# Altium project Prolift_MatrixDisplay_small.PrjPcb
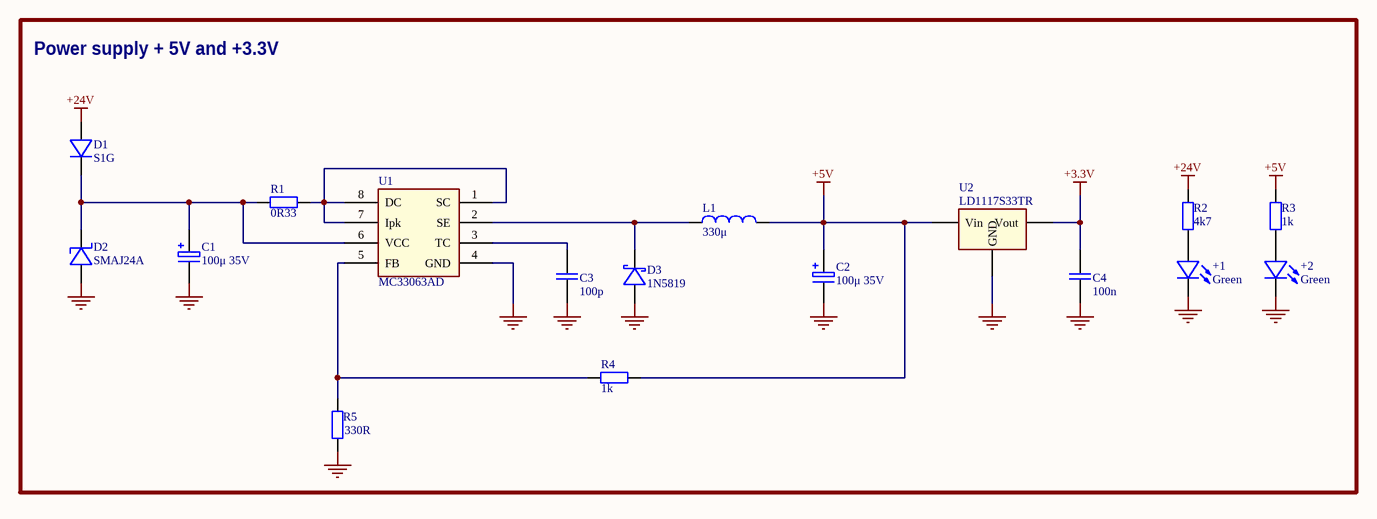
[diagram p0: Power supply.SchDoc]
4 sheets, 144 parts. Net scope: flat (ports and power ports of the same name join across sheets).
Board file: MatrixDisplay_small_V2.PcbDoc
Sheets:
  Power supply.SchDoc
  Microcontroller.SchDoc
  BinaryInput2.SchDoc
  LedMatrix.SchDoc

## Sheet Power supply.SchDoc
size A4

### Parts
+1  Green  [D LED green 0805]
+2  Green  [D LED green 0805]
C1  100μ 35V  [Cap Pol Size D]
C2  100μ 35V  [Cap Pol Size D]
C3  100p  [Cap 0805]
C4  100n  [Cap 0805]
D1  S1G  [DO-214AC (SMA)]
D2  SMAJ24A  [DO-214AC (SMA)]
D3  1N5819  [SOD-123]
L1  330μ  [SRR1050A]
R1  0R33  [Res 0805]
R2  4k7  [Res 0805]
R3  1k  [Res 0805]
R4  1k  [Res 0805]
R5  330R  [Res 0805]
U1  MC33063AD  [SOIC-8]
U2  LD1117S33TR  [SOT-223 (Tab=Pin 2)]

### Blocks framed on the sheet
Power supply + 5V and +3.3V: +1 +2 C1-C4 D1-D3 L1 R1-R5 U1 U2

### Nets
+3.3V: C4.1 U2.2(Vout)
+5V: C2.1 L1.2 R3.2 R4.2 U2.3(Vin)
+24V: D1.2 R2.2
GND: +1.1 +2.1 C1.2 C2.2 C3.2 C4.2 D2.2 D3.A R5.1 U1.4(GND) U2.1(GND)
Net+1_2: +1.2 R2.1
Net+2_2: +2.2 R3.1
NetC1_1: C1.1 D1.1 D2.1 R1.1 U1.6(VCC)
NetC3_1: C3.1 U1.3(TC)
NetD3_K: D3.K L1.1 U1.2(SE)
NetR1_2: R1.2 U1.1(SC) U1.7(Ipk) U1.8(DC)
NetR4_1: R4.1 R5.2 U1.5(FB)

### Library data of the parts
+1 +2 = D LED green: LED green SMD 0805
C1 C2 = Cap Al El 100uF 35V SMD size D: Electrolytic Capacitor 100uF 35V SMD size D
C3 = Cap 100pF 50V 0805 SMD: Capacitor 100pF 50V 0805 SMD
C4 = Cap 100nF 50V 0805 SMD: Capacitor 100nF 50V 0805 SMD
D1 = D S1G: Diode SMD DO-214AC (SMA)
D2 = D SMAJ24A: Diode SMD DO-214AC (SMA)
D3 = D 1N5819: Diode SMD SOD-123
L1 = Inductor 330uH VLP8040T-331M SMD
R1 = Res 0R33 0805 SMD: Resistor 0R33 0805 SMD
R2 = Res 4k7 0805 SMD: Resistor 4k7 0805 SMD
R3 R4 = Res 1k 0805 SMD: Resistor 1k 0805 SMD
R5 = Res 330k 1% 0805 SMD: Resistor 330k 1% 0805 SMD
U1 = MC33063AD: Switching regulator, SOIC 8-pin, -40°C to +85°C
U2 = LD1117S33TR: Voltage regulator, 3.3 V, 800 mA, SOT-223

## Sheet Microcontroller.SchDoc
size A
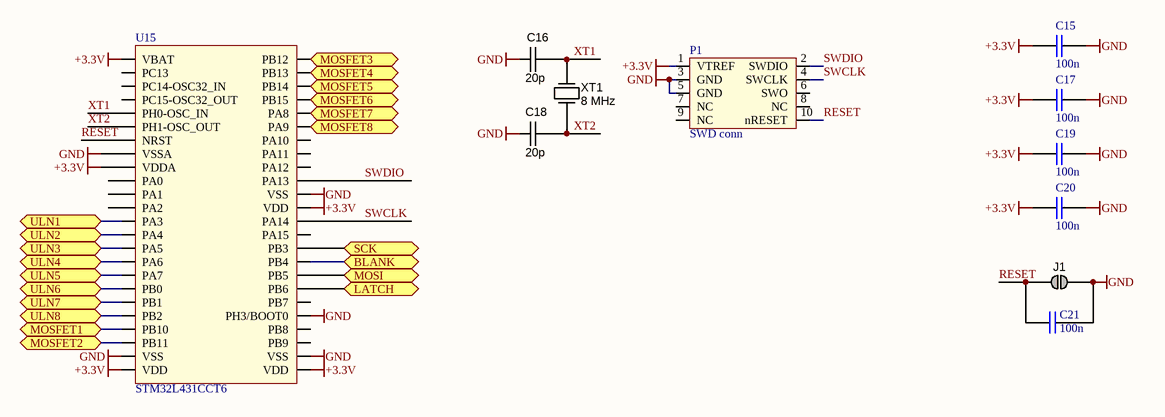
[diagram p1: Microcontroller.SchDoc]

### Parts
C15  100n  [Cap 0603]
C16  value 20p  [CAPC2012X135N]  (hidden comment: approved sub OK)
C17  100n  [Cap 0603]
C18  value 20p  [CAPC2012X135N]  (hidden comment: approved sub OK)
C19  100n  [Cap 0603]
C20  100n  [Cap 0603]
C21  100n  [Cap 0603]
J1  Jumper  [HDR1X2]  (value not drawn)  (no BOM)
P1  SWD conn  [SWD connector]
U15  STM32L431CCT6  [STM-LQFP48]
XT1  8 MHz  [CRYSTAL_HC49-US-SM]

### Ports
BLANK, LATCH, MOSFET1, MOSFET2, MOSFET3, MOSFET4, MOSFET5, MOSFET6, MOSFET7, MOSFET8, MOSI, SCK, ULN1, ULN2, ULN3, ULN4, ULN5, ULN6, ULN7, ULN8

### Nets
+3.3V: C15.1 C17.1 C19.1 C20.1 P1.1(VTREF) U15.1(VBAT) U15.9(VDDA) U15.24(VDD) U15.36(VDD) U15.48(VDD)
GND: C15.2 C16.2 C17.2 C18.2 C19.2 C20.2 C21.1 J1.2 P1.3(GND) P1.5(GND) U15.8(VSSA) U15.23(VSS) U15.35(VSS) U15.44(PH3/BOOT0) U15.47(VSS)
RESET: C21.2 J1.1 P1.10(nRESET) U15.7(NRST)
SWCLK: P1.4(SWCLK) U15.37(PA14)
SWDIO: P1.2(SWDIO) U15.34(PA13)
XT1: C16.1 U15.5(PH0-OSC_IN) XT1.2(OUT)
XT2: C18.1 U15.6(PH1-OSC_OUT) XT1.1(IN)
NetU5_11: U15.20(PB2) ; port ULN8
NetU5_12: U15.19(PB1) ; port ULN7
NetU5_13: U15.18(PB0) ; port ULN6
NetU5_14: U15.17(PA7) ; port ULN5
NetU5_15: U15.16(PA6) ; port ULN4
NetU5_16: U15.15(PA5) ; port ULN3
NetU5_17: U15.14(PA4) ; port ULN2
NetU5_18: U15.13(PA3) ; port ULN1
NetU6_1: U15.21(PB10) ; port MOSFET1
NetU6_3: U15.22(PB11) ; port MOSFET2
NetU7_1: U15.41(PB5) ; port MOSI
NetU7_3: U15.26(PB13) ; port MOSFET4
NetU8_1: U15.25(PB12) ; port MOSFET3
NetU8_3: U15.39(PB3) ; port SCK
NetU10_1: U15.42(PB6) ; port LATCH
NetU10_3: U15.40(PB4) ; port BLANK
NetU11_1: U15.27(PB14) ; port MOSFET5
NetU11_3: U15.28(PB15) ; port MOSFET6
NetU12_1: U15.29(PA8) ; port MOSFET7
NetU12_3: U15.30(PA9) ; port MOSFET8

Not connected (* = marked no-connect by the designer): P1 6(SWO) 7(NC) 8(NC) 9(NC); U15 2(PC13) 3(PC14-OSC32_IN) 4(PC15-OSC32_OUT) 10(PA0) 11(PA1) 12(PA2) 31(PA10) 32(PA11) 33(PA12) 38(PA15) 43(PB7) 45(PB8) 46(PB9)

### Library data of the parts
C15 C17 C19-C21 = Cap 100nF 50V 0603 SMD: Capacitor 100nF 50V 0603 SMD
C16 C18 = CAPC_100n_0805_X7R_50V_10%: Capacitor SMD Cer 100nF 10% 50V X7R 0805; Manufacturer 1: Kemet; Manufacturer Part Number 1: C0805C104K5RACTU; Ratings: 50V; X7R; Material: ceramic; SCDType: undef; Package / Case: 0805 (2012 metric); Tolerance: ±10%; Supplier 1: Digi-Key; Supplier Part Number 1: 399-1170-1-ND
J1 = JUMP1: SMD jumper
P1 = SW_debug: SWD connector
U15 = STM32L431CCT6: STM32 L4; Mouser: 511-STM32L431CCT6
XT1 = Crystal_6MHz_HC49/US: Resonator Ceramic 6.00 MHz 30ppm; Manufacturer 1: CTS-Frequency Controls; Manufacturer Part Number 1: ATS060BSM-1; Frequency: 6MHz; Frequency Stability: ±50ppm; Load Capacitance: 18pF; Operating Mode: Fundamental; Parameter Name: 0.169" (4.30mm); SCDType: spec; Package / Case: HC49/US-SM; Ratings: 6.00 MHz; Supplier 1: Digi-Key; Supplier Part Number 1: CTX882CT-ND; Type: MHz Crystal; Frequency Tolerance: ±30ppm; Operating Temperature: -20°C ~ 70°C; Mounting Type: Surface Mount; Size / Dimension: 0.437" L x 0.190" W (11.10mm x 4.83mm); ComponentLink1URL: http://www.ctscorp.com/components/Datasheets/008-0309-0.pdf; ComponentLink1Description: http://www.ctscorp.com/components/Datasheets/008-0309-0.pdf

## Sheet BinaryInput2.SchDoc
size A4
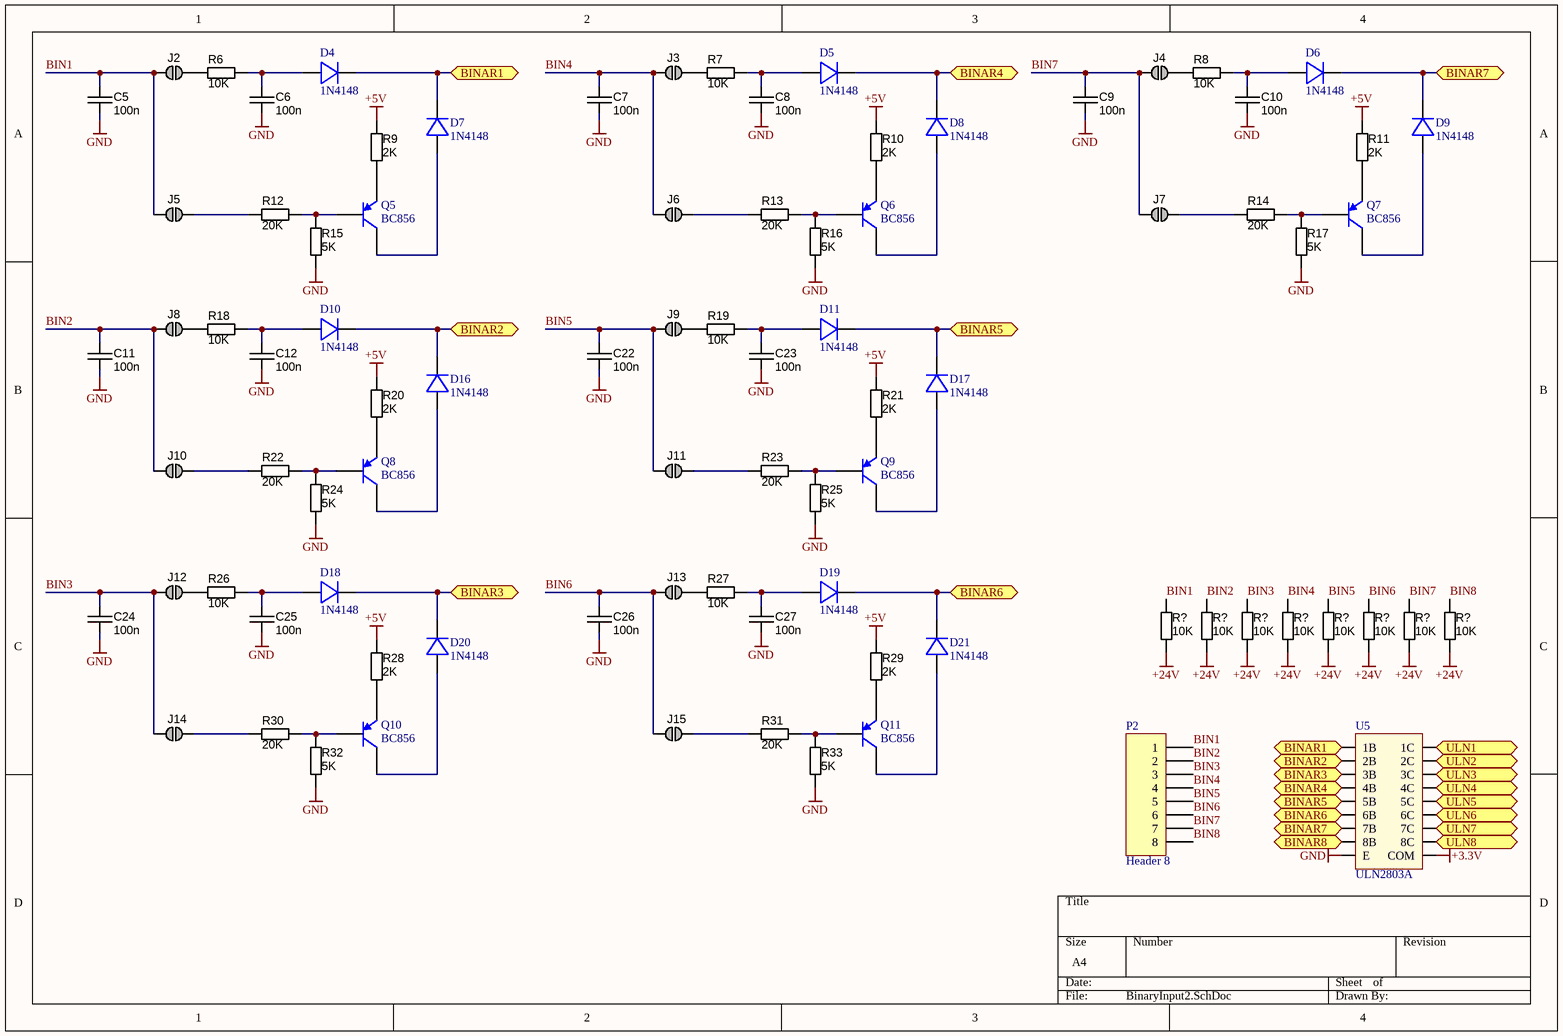
[diagram p2: BinaryInput2.SchDoc]

### Parts
(Parts that share a designator on the sheet are numbered #1, #2 ... from top to bottom, then left to right.)
C5  value 100n  [CAPC2012X135N]  (hidden comment: approved sub OK)
C6  value 100n  [CAPC2012X135N]  (hidden comment: approved sub OK)
C7  value 100n  [CAPC2012X135N]  (hidden comment: approved sub OK)
C8  value 100n  [CAPC2012X135N]  (hidden comment: approved sub OK)
C9  value 100n  [CAPC2012X135N]  (hidden comment: approved sub OK)
C10  value 100n  [CAPC2012X135N]  (hidden comment: approved sub OK)
C11  value 100n  [CAPC2012X135N]  (hidden comment: approved sub OK)
C12  value 100n  [CAPC2012X135N]  (hidden comment: approved sub OK)
C22  value 100n  [CAPC2012X135N]  (hidden comment: approved sub OK)
C23  value 100n  [CAPC2012X135N]  (hidden comment: approved sub OK)
C24  value 100n  [CAPC2012X135N]  (hidden comment: approved sub OK)
C25  value 100n  [CAPC2012X135N]  (hidden comment: approved sub OK)
C26  value 100n  [CAPC2012X135N]  (hidden comment: approved sub OK)
C27  value 100n  [CAPC2012X135N]  (hidden comment: approved sub OK)
D4  1N4148  [SOD-123]
D5  1N4148  [SOD-123]
D6  1N4148  [SOD-123]
D7  1N4148  [SOD-123]
D8  1N4148  [SOD-123]
D9  1N4148  [SOD-123]
D10  1N4148  [SOD-123]
D11  1N4148  [SOD-123]
D16  1N4148  [SOD-123]
D17  1N4148  [SOD-123]
D18  1N4148  [SOD-123]
D19  1N4148  [SOD-123]
D20  1N4148  [SOD-123]
D21  1N4148  [SOD-123]
J2  Jumper  [JUMP1]  (value not drawn)  (no BOM)
J3  Jumper  [JUMP1]  (value not drawn)  (no BOM)
J4  Jumper  [JUMP1]  (value not drawn)  (no BOM)
J5  Jumper  [JUMP1]  (value not drawn)  (no BOM)
J6  Jumper  [JUMP1]  (value not drawn)  (no BOM)
J7  Jumper  [JUMP1]  (value not drawn)  (no BOM)
J8  Jumper  [JUMP1]  (value not drawn)  (no BOM)
J9  Jumper  [JUMP1]  (value not drawn)  (no BOM)
J10  Jumper  [JUMP1]  (value not drawn)  (no BOM)
J11  Jumper  [JUMP1]  (value not drawn)  (no BOM)
J12  Jumper  [JUMP1]  (value not drawn)  (no BOM)
J13  Jumper  [JUMP1]  (value not drawn)  (no BOM)
J14  Jumper  [JUMP1]  (value not drawn)  (no BOM)
J15  Jumper  [JUMP1]  (value not drawn)  (no BOM)
P2  Header 8  [HDR1X8]
Q5  BC856  [SOT-23-3]
Q6  BC856  [SOT-23-3]
Q7  BC856  [SOT-23-3]
Q8  BC856  [SOT-23-3]
Q9  BC856  [SOT-23-3]
Q10  BC856  [SOT-23-3]
Q11  BC856  [SOT-23-3]
R6  value 10K  [RESC2012X70N]  (hidden comment: Thick Film)
R7  value 10K  [RESC2012X70N]  (hidden comment: Thick Film)
R8  value 10K  [RESC2012X70N]  (hidden comment: Thick Film)
R9  value 2K  [RESC2012X70N]  (hidden comment: Thick Film)
R10  value 2K  [RESC2012X70N]  (hidden comment: Thick Film)
R11  value 2K  [RESC2012X70N]  (hidden comment: Thick Film)
R12  value 20K  [RESC2012X70N]  (hidden comment: Thick Film)
R13  value 20K  [RESC2012X70N]  (hidden comment: Thick Film)
R14  value 20K  [RESC2012X70N]  (hidden comment: Thick Film)
R15  value 5K  [RESC2012X70N]  (hidden comment: Thick Film)
R16  value 5K  [RESC2012X70N]  (hidden comment: Thick Film)
R17  value 5K  [RESC2012X70N]  (hidden comment: Thick Film)
R18  value 10K  [RESC2012X70N]  (hidden comment: Thick Film)
R19  value 10K  [RESC2012X70N]  (hidden comment: Thick Film)
R20  value 2K  [RESC2012X70N]  (hidden comment: Thick Film)
R21  value 2K  [RESC2012X70N]  (hidden comment: Thick Film)
R22  value 20K  [RESC2012X70N]  (hidden comment: Thick Film)
R23  value 20K  [RESC2012X70N]  (hidden comment: Thick Film)
R24  value 5K  [RESC2012X70N]  (hidden comment: Thick Film)
R25  value 5K  [RESC2012X70N]  (hidden comment: Thick Film)
R26  value 10K  [RESC2012X70N]  (hidden comment: Thick Film)
R27  value 10K  [RESC2012X70N]  (hidden comment: Thick Film)
R28  value 2K  [RESC2012X70N]  (hidden comment: Thick Film)
R29  value 2K  [RESC2012X70N]  (hidden comment: Thick Film)
R30  value 20K  [RESC2012X70N]  (hidden comment: Thick Film)
R31  value 20K  [RESC2012X70N]  (hidden comment: Thick Film)
R32  value 5K  [RESC2012X70N]  (hidden comment: Thick Film)
R33  value 5K  [RESC2012X70N]  (hidden comment: Thick Film)
R?#1  value 10K  [RESC2012X70N]  (hidden comment: Thick Film)
R?#2  value 10K  [RESC2012X70N]  (hidden comment: Thick Film)
R?#3  value 10K  [RESC2012X70N]  (hidden comment: Thick Film)
R?#4  value 10K  [RESC2012X70N]  (hidden comment: Thick Film)
R?#5  value 10K  [RESC2012X70N]  (hidden comment: Thick Film)
R?#6  value 10K  [RESC2012X70N]  (hidden comment: Thick Film)
R?#7  value 10K  [RESC2012X70N]  (hidden comment: Thick Film)
R?#8  value 10K  [RESC2012X70N]  (hidden comment: Thick Film)
U5  ULN2803A  [SOP18]

### Ports
BINAR1, BINAR2, BINAR3, BINAR4, BINAR5, BINAR6, BINAR7, BINAR8, ULN1, ULN2, ULN3, ULN4, ULN5, ULN6, ULN7, ULN8

### Nets
+3.3V: U5.10(COM)
+5V: R9.2 R10.2 R11.2 R20.2 R21.2 R28.2 R29.2
+24V: R?#1.1 R?#2.1 R?#3.1 R?#4.1 R?#5.1 R?#6.1 R?#7.1 R?#8.1
GND: C5.2 C6.2 C7.2 C8.2 C9.2 C10.2 C11.2 C12.2 C22.2 C23.2 C24.2 C25.2 C26.2 C27.2 R15.1 R16.1 R17.1 R24.1 R25.1 R32.1 R33.1 U5.9(E)
BIN1: C5.1 J2.2 J5.2 P2.1 R?#1.2
BIN2: C11.1 J8.2 J10.2 P2.2 R?#2.2
BIN3: C24.1 J12.2 J14.2 P2.3 R?#3.2
BIN4: C7.1 J3.2 J6.2 P2.4 R?#4.2
BIN5: C22.1 J9.2 J11.2 P2.5 R?#5.2
BIN6: C26.1 J13.2 J15.2 P2.6 R?#6.2
BIN7: C9.1 J4.2 J7.2 P2.7 R?#7.2
BIN8: P2.8 R?#8.2
NetC6_1: C6.1 D4.A R6.2
NetC8_1: C8.1 D5.A R7.2
NetC10_1: C10.1 D6.A R8.2
NetC12_1: C12.1 D10.A R18.2
NetC23_1: C23.1 D11.A R19.2
NetC25_1: C25.1 D18.A R26.2
NetC27_1: C27.1 D19.A R27.2
NetD4_K: D4.K D7.K U5.1(1B) ; port BINAR1
NetD5_K: D5.K D8.K U5.4(4B) ; port BINAR4
NetD6_K: D6.K D9.K U5.7(7B) ; port BINAR7
NetD7_A: D7.A Q5.3(C)
NetD8_A: D8.A Q6.3(C)
NetD9_A: D9.A Q7.3(C)
NetD10_K: D10.K D16.K U5.2(2B) ; port BINAR2
NetD11_K: D11.K D17.K U5.5(5B) ; port BINAR5
NetD16_A: D16.A Q8.3(C)
NetD17_A: D17.A Q9.3(C)
NetD18_K: D18.K D20.K U5.3(3B) ; port BINAR3
NetD19_K: D19.K D21.K U5.6(6B) ; port BINAR6
NetD20_A: D20.A Q10.3(C)
NetD21_A: D21.A Q11.3(C)
NetJ2_1: J2.1 R6.1
NetJ3_1: J3.1 R7.1
NetJ4_1: J4.1 R8.1
NetJ5_1: J5.1 R12.1
NetJ6_1: J6.1 R13.1
NetJ7_1: J7.1 R14.1
NetJ8_1: J8.1 R18.1
NetJ9_1: J9.1 R19.1
NetJ10_1: J10.1 R22.1
NetJ11_1: J11.1 R23.1
NetJ12_1: J12.1 R26.1
NetJ13_1: J13.1 R27.1
NetJ14_1: J14.1 R30.1
NetJ15_1: J15.1 R31.1
NetQ5_1: Q5.1(B) R12.2 R15.2
NetQ5_2: Q5.2(E) R9.1
NetQ6_1: Q6.1(B) R13.2 R16.2
NetQ6_2: Q6.2(E) R10.1
NetQ7_1: Q7.1(B) R14.2 R17.2
NetQ7_2: Q7.2(E) R11.1
NetQ8_1: Q8.1(B) R22.2 R24.2
NetQ8_2: Q8.2(E) R20.1
NetQ9_1: Q9.1(B) R23.2 R25.2
NetQ9_2: Q9.2(E) R21.1
NetQ10_1: Q10.1(B) R30.2 R32.2
NetQ10_2: Q10.2(E) R28.1
NetQ11_1: Q11.1(B) R31.2 R33.2
NetQ11_2: Q11.2(E) R29.1
NetU5_8: U5.8(8B) ; port BINAR8
NetU5_11: U5.11(8C) ; port ULN8
NetU5_12: U5.12(7C) ; port ULN7
NetU5_13: U5.13(6C) ; port ULN6
NetU5_14: U5.14(5C) ; port ULN5
NetU5_15: U5.15(4C) ; port ULN4
NetU5_16: U5.16(3C) ; port ULN3
NetU5_17: U5.17(2C) ; port ULN2
NetU5_18: U5.18(1C) ; port ULN1

### Library data of the parts
C5-C12 C22-C27 = CAPC_100n_0805_X7R_50V_10%: as C16 on sheet Microcontroller; Package / Case: 0805 (2012 metric); Tolerance: ±10%; Supplier 1: Digi-Key; Supplier Part Number 1: 399-1170-1-ND
D4-D11 D16-D21 = D 1N4148: Diode SMD SOD-323
J2-J15 = JUMP1: SMD jumper
P2 = Header 8: Header, 8-Pin; LatestRevisionDate: 17-Jul-2002; LatestRevisionNote: Re-released for DXP Platform.; Publisher: Altium Limited
Q5-Q11 = Q BC856: BJT PNP
R6-R33 R?#1-R?#8 = RES_10K_0805_1%: Resistor SMD chip 10k Ohm 0.125W 1% 0805; Manufacturer 1: Vishay/Dale; Manufacturer Part Number 1: CRCW080510K0FKEA; Ratings: 1/8W; SCDType: spec; Package / Case: 0805 (2012 metric); Supplier 1: Digi-Key; Supplier Part Number 1: 541-10.0KCCT-ND; Material: Thick Film; Tolerance: ±1%
U5 = ULN2803A: Darlington Transistor Arrays; Mouser: 595-ULN2803ADWR

## Sheet LedMatrix.SchDoc
size A3
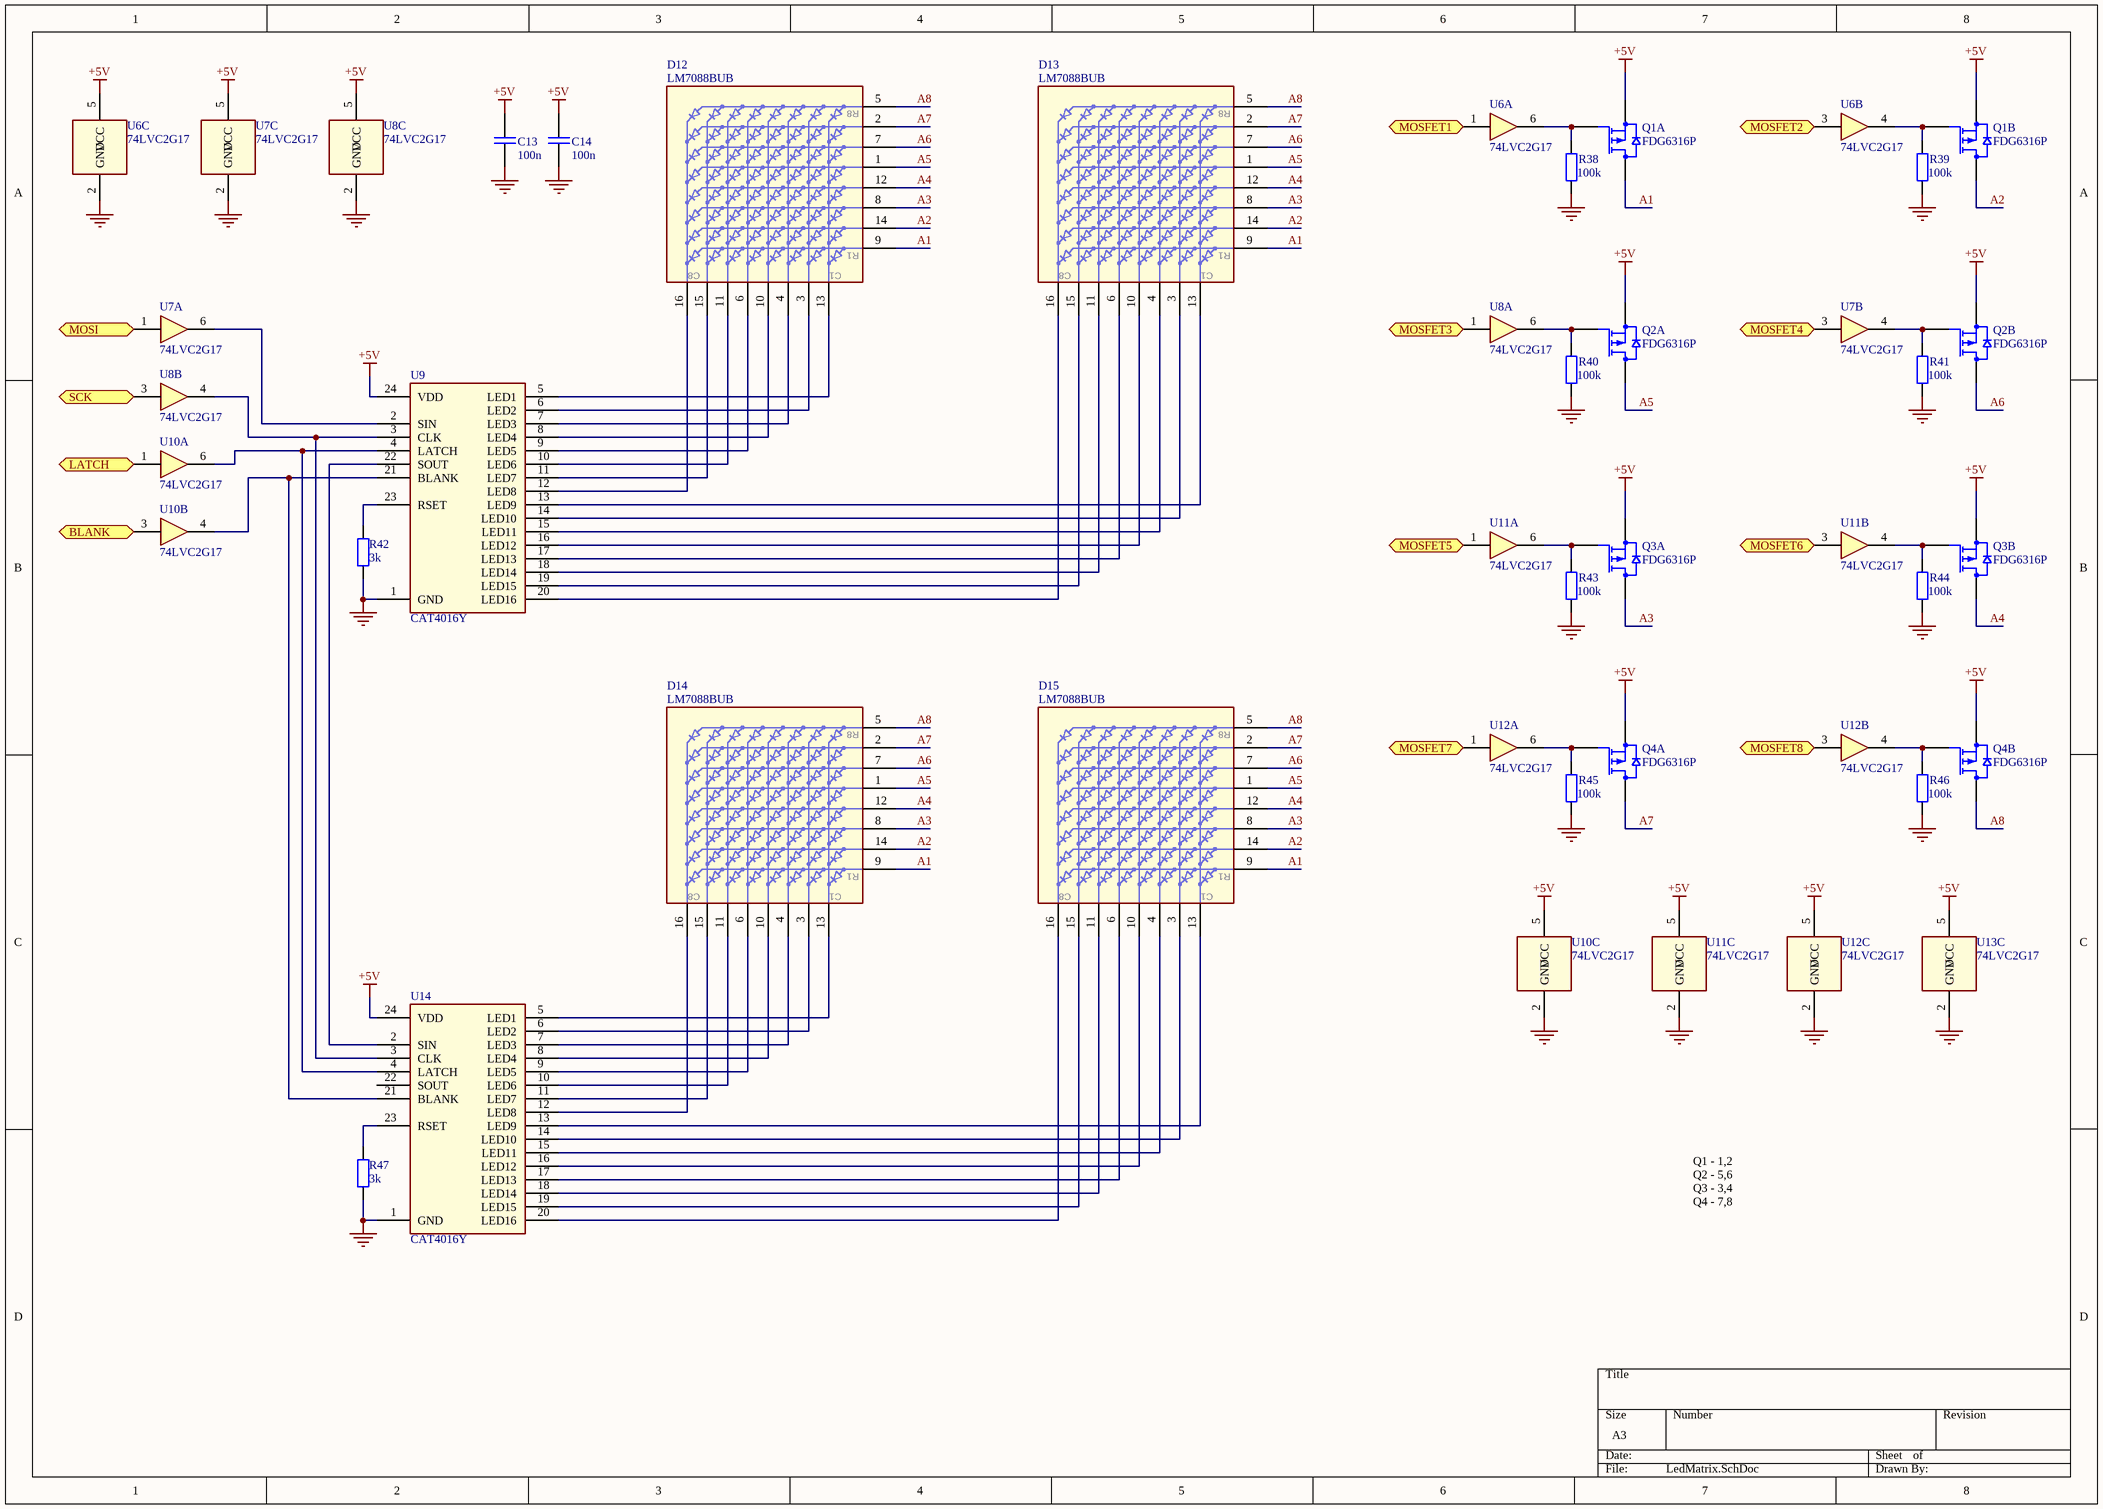
[diagram p3: LedMatrix.SchDoc]

### Parts
C13  100n  [Cap 0603]
C14  100n  [Cap 0603]
D12  LM7088BUB  [KWM-19881 Series]
D13  LM7088BUB  [KWM-19881 Series]
D14  LM7088BUB  [KWM-19881 Series]
D15  LM7088BUB  [KWM-19881 Series]
Q1  FDG6316P  [SC-70-6 (SOT-363)]  (parts A,B of 2)
Q2  FDG6316P  [SC-70-6 (SOT-363)]  (parts A,B of 2)
Q3  FDG6316P  [SC-70-6 (SOT-363)]  (parts A,B of 2)
Q4  FDG6316P  [SC-70-6 (SOT-363)]  (parts A,B of 2)
R38  100k  [Res 0603]
R39  100k  [Res 0603]
R40  100k  [Res 0603]
R41  100k  [Res 0603]
R42  3k  [Res 0603]
R43  100k  [Res 0603]
R44  100k  [Res 0603]
R45  100k  [Res 0603]
R46  100k  [Res 0603]
R47  3k  [Res 0603]
U6  74LVC2G17  [SOT-23-6]  (parts A,B,C of 3)
U7  74LVC2G17  [SOT-23-6]  (parts A,B,C of 3)
U8  74LVC2G17  [SOT-23-6]  (parts A,B,C of 3)
U9  CAT4016Y  [TSSOP-24]
U10  74LVC2G17  [SOT-23-6]  (parts A,B,C of 3)
U11  74LVC2G17  [SOT-23-6]  (parts A,B,C of 3)
U12  74LVC2G17  [SOT-23-6]  (parts A,B,C of 3)
U13  74LVC2G17  [SOT-23-6]  (part C of 3)
U14  CAT4016Y  [TSSOP-24]

### Ports
BLANK, LATCH, MOSFET1, MOSFET2, MOSFET3, MOSFET4, MOSFET5, MOSFET6, MOSFET7, MOSFET8, MOSI, SCK

### Nets
+5V: C13.1 C14.1 Q1.1(S1) Q1.4(S2) Q2.1(S1) Q2.4(S2) Q3.1(S1) Q3.4(S2) Q4.1(S1) Q4.4(S2) U6.5(VCC) U7.5(VCC) U8.5(VCC) U9.24(VDD) U10.5(VCC) U11.5(VCC) U12.5(VCC) U13.5(VCC) U14.24(VDD)
GND: C13.2 C14.2 R38.1 R39.1 R40.1 R41.1 R42.1 R43.1 R44.1 R45.1 R46.1 R47.1 U6.2(GND) U7.2(GND) U8.2(GND) U9.1(GND) U10.2(GND) U11.2(GND) U12.2(GND) U13.2(GND) U14.1(GND)
A1: D12.9(R1) D13.9(R1) D14.9(R1) D15.9(R1) Q1.6(D1)
A2: D12.14(R2) D13.14(R2) D14.14(R2) D15.14(R2) Q1.3(D2)
A3: D12.8(R3) D13.8(R3) D14.8(R3) D15.8(R3) Q3.6(D1)
A4: D12.12(R4) D13.12(R4) D14.12(R4) D15.12(R4) Q3.3(D2)
A5: D12.1(R5) D13.1(R5) D14.1(R5) D15.1(R5) Q2.6(D1)
A6: D12.7(R6) D13.7(R6) D14.7(R6) D15.7(R6) Q2.3(D2)
A7: D12.2(R7) D13.2(R7) D14.2(R7) D15.2(R7) Q4.6(D1)
A8: D12.5(R8) D13.5(R8) D14.5(R8) D15.5(R8) Q4.3(D2)
NetD12_3: D12.3(C2) U9.6(LED2)
NetD12_4: D12.4(C3) U9.7(LED3)
NetD12_6: D12.6(C5) U9.9(LED5)
NetD12_10: D12.10(C4) U9.8(LED4)
NetD12_11: D12.11(C6) U9.10(LED6)
NetD12_13: D12.13(C1) U9.5(LED1)
NetD12_15: D12.15(C7) U9.11(LED7)
NetD12_16: D12.16(C8) U9.12(LED8)
NetD13_3: D13.3(C2) U9.14(LED10)
NetD13_4: D13.4(C3) U9.15(LED11)
NetD13_6: D13.6(C5) U9.17(LED13)
NetD13_10: D13.10(C4) U9.16(LED12)
NetD13_11: D13.11(C6) U9.18(LED14)
NetD13_13: D13.13(C1) U9.13(LED9)
NetD13_15: D13.15(C7) U9.19(LED15)
NetD13_16: D13.16(C8) U9.20(LED16)
NetD14_3: D14.3(C2) U14.6(LED2)
NetD14_4: D14.4(C3) U14.7(LED3)
NetD14_6: D14.6(C5) U14.9(LED5)
NetD14_10: D14.10(C4) U14.8(LED4)
NetD14_11: D14.11(C6) U14.10(LED6)
NetD14_13: D14.13(C1) U14.5(LED1)
NetD14_15: D14.15(C7) U14.11(LED7)
NetD14_16: D14.16(C8) U14.12(LED8)
NetD15_3: D15.3(C2) U14.14(LED10)
NetD15_4: D15.4(C3) U14.15(LED11)
NetD15_6: D15.6(C5) U14.17(LED13)
NetD15_10: D15.10(C4) U14.16(LED12)
NetD15_11: D15.11(C6) U14.18(LED14)
NetD15_13: D15.13(C1) U14.13(LED9)
NetD15_15: D15.15(C7) U14.19(LED15)
NetD15_16: D15.16(C8) U14.20(LED16)
NetQ1_2: Q1.2(G1) R38.2 U6.6
NetQ1_5: Q1.5(G2) R39.2 U6.4
NetQ2_2: Q2.2(G1) R40.2 U8.6
NetQ2_5: Q2.5(G2) R41.2 U7.4
NetQ3_2: Q3.2(G1) R43.2 U11.6
NetQ3_5: Q3.5(G2) R44.2 U11.4
NetQ4_2: Q4.2(G1) R45.2 U12.6
NetQ4_5: Q4.5(G2) R46.2 U12.4
NetR42_2: R42.2 U9.23(RSET)
NetR47_2: R47.2 U14.23(RSET)
NetU6_1: U6.1 ; port MOSFET1
NetU6_3: U6.3 ; port MOSFET2
NetU7_1: U7.1 ; port MOSI
NetU7_3: U7.3 ; port MOSFET4
NetU7_6: U7.6 U9.2(SIN)
NetU8_1: U8.1 ; port MOSFET3
NetU8_3: U8.3 ; port SCK
NetU8_4: U8.4 U9.3(CLK) U14.3(CLK)
NetU9_4: U9.4(LATCH) U10.6 U14.4(LATCH)
NetU9_21: U9.21(BLANK) U10.4 U14.21(BLANK)
NetU9_22: U9.22(SOUT) U14.2(SIN)
NetU10_1: U10.1 ; port LATCH
NetU10_3: U10.3 ; port BLANK
NetU11_1: U11.1 ; port MOSFET5
NetU11_3: U11.3 ; port MOSFET6
NetU12_1: U12.1 ; port MOSFET7
NetU12_3: U12.3 ; port MOSFET8

Not connected (* = marked no-connect by the designer): U14 22(SOUT)

### Notes on the sheet
- Q1 - 1,2
  Q2 - 5,6
  Q3 - 3,4
  Q4 - 7,8

### Library data of the parts
C13 C14 = Cap: Capacitor
D12-D15 = D LED LM7088BUB: 8x8 Dot Matrix LED Display (Common Row Anode), Blue
Q1-Q4 = Q FDG6316P: P-Channel 1.8V Specified PowerTrench MOSFET
R38-R47 = Res: Resistor
U6-U8 U10-U13 = 74LVC2G17: Dual non-inverting Schmitt trigger with 5 V tolerant input
U9 U14 = CAT4016Y: 16-Channel Constant Current LED Driver

## Nets that join several sheets
+3.3V: Power supply (C4.1 U2.2), Microcontroller (10 pins), BinaryInput2 (U5.10)
+5V: Power supply (5 pins), BinaryInput2 (7 pins), LedMatrix (19 pins)
+24V: Power supply (D1.2 R2.2), BinaryInput2 (8 pins)
GND: Power supply (11 pins), Microcontroller (15 pins), BinaryInput2 (22 pins), LedMatrix (21 pins)
NetU5_11: Microcontroller (U15.20), BinaryInput2 (U5.11)
NetU5_12: Microcontroller (U15.19), BinaryInput2 (U5.12)
NetU5_13: Microcontroller (U15.18), BinaryInput2 (U5.13)
NetU5_14: Microcontroller (U15.17), BinaryInput2 (U5.14)
NetU5_15: Microcontroller (U15.16), BinaryInput2 (U5.15)
NetU5_16: Microcontroller (U15.15), BinaryInput2 (U5.16)
NetU5_17: Microcontroller (U15.14), BinaryInput2 (U5.17)
NetU5_18: Microcontroller (U15.13), BinaryInput2 (U5.18)
NetU6_1: Microcontroller (U15.21), LedMatrix (U6.1)
NetU6_3: Microcontroller (U15.22), LedMatrix (U6.3)
NetU7_1: Microcontroller (U15.41), LedMatrix (U7.1)
NetU7_3: Microcontroller (U15.26), LedMatrix (U7.3)
NetU8_1: Microcontroller (U15.25), LedMatrix (U8.1)
NetU8_3: Microcontroller (U15.39), LedMatrix (U8.3)
NetU10_1: Microcontroller (U15.42), LedMatrix (U10.1)
NetU10_3: Microcontroller (U15.40), LedMatrix (U10.3)
NetU11_1: Microcontroller (U15.27), LedMatrix (U11.1)
NetU11_3: Microcontroller (U15.28), LedMatrix (U11.3)
NetU12_1: Microcontroller (U15.29), LedMatrix (U12.1)
NetU12_3: Microcontroller (U15.30), LedMatrix (U12.3)